# EAGLE design dasblinkenhat-controller-mk-3.0 (EAGLE 7.5.0)
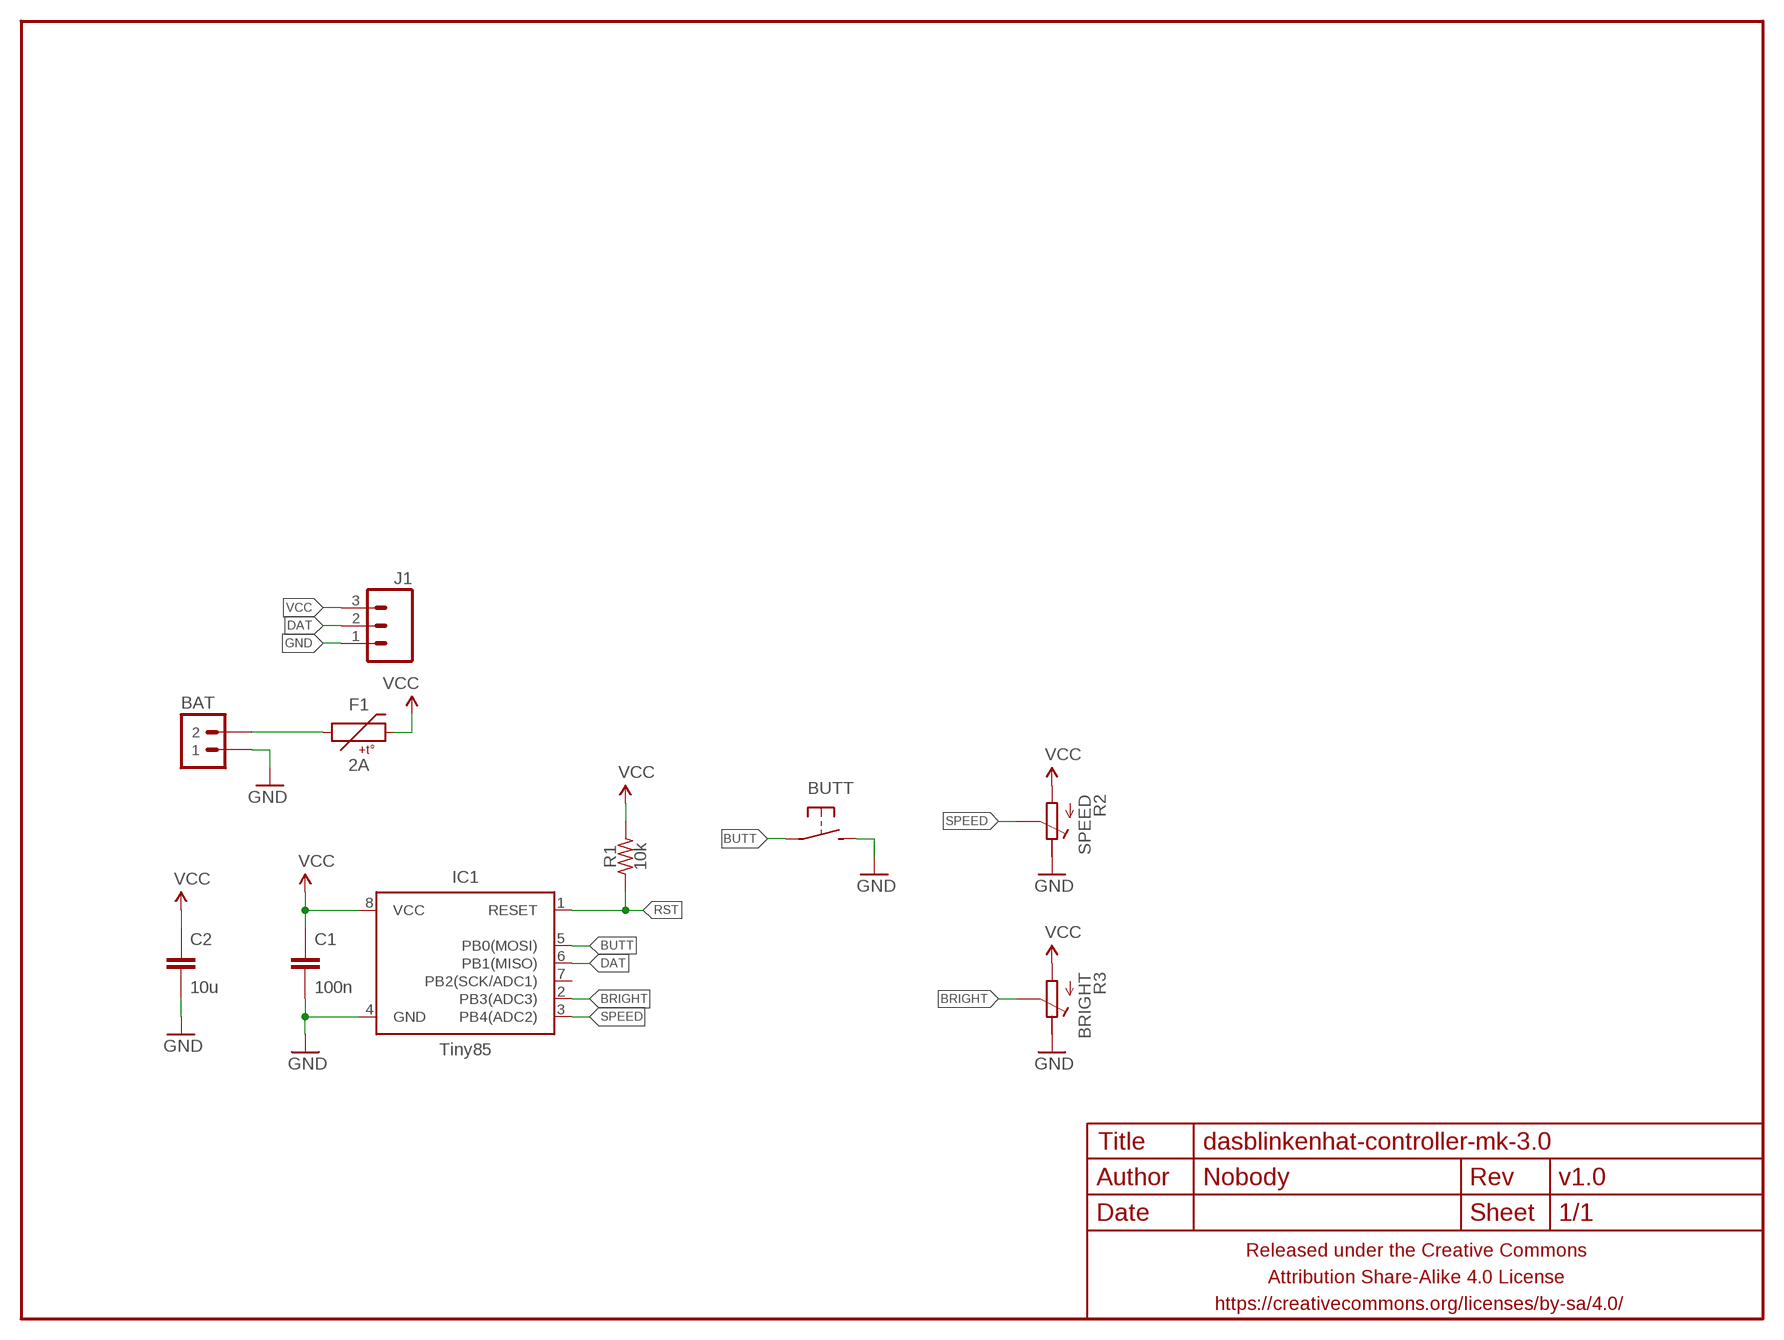
[diagram p0: schematic, sheet 1]

## Parts
BAT  M02JST-PTH-RA-R+  [JST-2-PH-RA-PTH-R+]
BUTT  DTS-6MM  SPST-NO-TACT6MM-SMD  [DTSM-6]
C1  100n  CAPACITOR-CERAMICC0603  [C0603]
C2  10u  CAPACITOR-CERAMICC1206  [C1206]
F1  2A  PTCSMD  [PTC-1206]
FRAME1  FRAME-LETTERNO_PACKAGE  [DUMMY]
IC1  Tiny85  ATTINY45TINY85-20-SOICW  [SO08-EIAJ]
J1  M03JST-XH-RA-PTH  [JST-3-XH-RA-PTH]
R1  10k  RESISTORR0603  [R0603]
R2  SPEED  POTENTIOMETEREVM3Y  [EVM3Y]
R3  BRIGHT  POTENTIOMETEREVM3Y  [EVM3Y]

## Nets
BRIGHT: IC1.2(PB3(ADC3)) R3.S
BUTT: BUTT.1 BUTT.2 IC1.5(PB0(MOSI))
DAT: IC1.6(PB1(MISO)) J1.2
GND: BAT.1 BUTT.3 BUTT.4 C1.2 C2.2 IC1.4(GND) J1.1 R2.E R3.E
N$1: BAT.2 F1.1
RST: IC1.1(RESET) R1.1
SPEED: IC1.3(PB4(ADC2)) R2.S
VCC: C1.1 C2.1 F1.2 IC1.8(VCC) J1.3 R1.2 R2.A R3.A
Unconnected: IC1.7(PB2(SCK/ADC1))

## Library data of the parts
BAT = a_parts:M02: Standard 2-pin 0.1" header. Use with - straight break away headers ( PRT-00116) - right angle break away headers (PRT-00553) - swiss pins (PRT-00743) - machine pins (PRT-00117) - female headers (PRT-00115) Molex polarized connector foot print use with: PRT-08233 with associated crimp pins and housings. 2.54_SCREWTERM for use with PRT-10571. 3.5mm Screw Terminal footprints for PRT-08084 5mm Screw Terminal footprints for use with PRT-08433
BUTT = A_butts:SPST-NO-TACT
C1 C2 = A_butts:CAPACITOR-CERAMIC: CAPACITOR, European symbol
F1 = a_parts:PTC: Resettable Fuse PTC Resettable Fuse. Spark Fun Electronics SKU : COM-08357; PROD_ID: RES-11150
FRAME1 = a_parts:FRAME-LETTER: Schematic Frame Standard 8.5x11 US Letter frame; DESIGNER: Nobody; VERSION: v1.0
IC1 = A_butts:ATTINY45: Atmel 8-pin 2/4/8kB flash uC; PROD_ID: IC-09092; VALUE: Tiny85-20-SMT
J1 = a_parts:M03: Header 3 Standard 3-pin 0.1" header. Use with straight break away headers (SKU : PRT-00116), right angle break away headers (PRT-00553), swiss pins (PRT-00743), machine pins (PRT-00117), and female headers (PRT-00115). Molex polarized connector foot print use with SKU : PRT-08232 with associated crimp pins and housings.
R1 = A_butts:RESISTOR: RESISTOR, American symbol
R2 R3 = a_parts:POTENTIOMETER: Trimm resistor

## Board
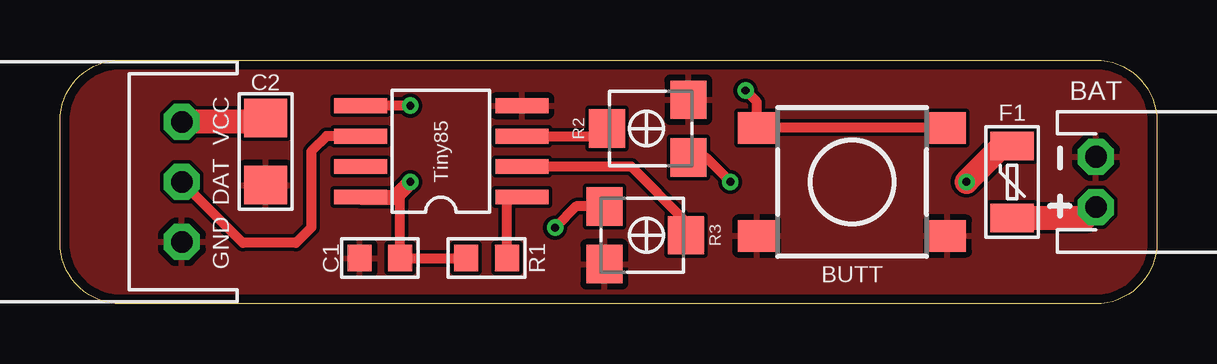
[diagram p1: board, top side]
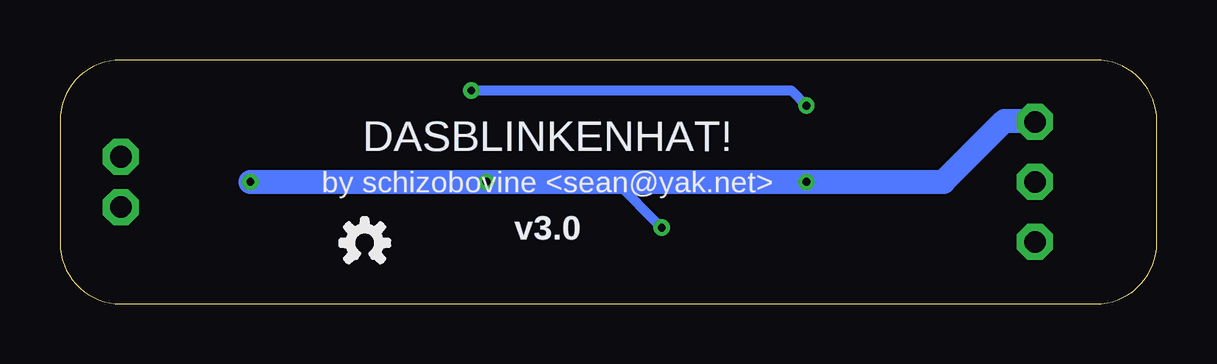
[diagram p2: board, bottom side, seen from below]

Size 45.72 x 10.16 mm. Coordinates in mm from the lower left corner, seen from the top.
Outline: 2.54,10.16 43.18,10.16 arc-90 45.72,7.62 45.72,2.54 arc-90 43.18,0 2.54,0 arc-90 0,2.54 0,7.62 arc-90 2.54,10.16
Copper layers (1*16): Top 0.0356mm / dielectric 1.5011mm / Bottom 0.0356mm
Design rules "LaenPCBOrder2": minimum track width 6mil, minimum drill 13mil, track to track 6mil, track to pad 6mil, pad to pad 6mil, via to via 6mil, smd to smd 6mil, copper to edge 15mil, drill to drill 6mil, minimum pad ring 7mil, minimum via ring 7mil, stop-mask expansion 3mil, vias tented up to drill 20mil, thermal gap 10mil

### Footprints (pad centres in the part's own frame; a part is rotated, then mirrored left to right if it is on the bottom)
JST-2-PH-RA-PTH-R+ = drill 0.9 pad 1.5 octagon: 1 -1.05,0; 2 1.05,0
DTSM-6 = smd 1.55 x 1.3: 1 -3.975,2.25; 2 3.975,2.25; 3 -3.975,-2.25; 4 3.975,-2.25
C0603 = smd 1 x 1.1: 1 -0.85,0; 2 0.85,0
C1206 = smd 1.6 x 1.8: 1 -1.4,0; 2 1.4,0
PTC-1206 = smd 1.2 x 1.8: 1 -1.5,0; 2 1.5,0
SO08-EIAJ = smd 0.61 x 2.21: 1 -1.905,-3.378; 2 -0.635,-3.378; 3 0.635,-3.378; 4 1.905,-3.378; 5 1.905,3.353; 6 0.635,3.353; 7 -0.635,3.353; 8 -1.905,3.353
JST-3-XH-RA-PTH = drill 0.9 pad 1.5 octagon: 1 -2.5,0; 2 0,0; 3 2.5,0
R0603 = smd 1 x 1.1: 1 -0.85,0; 2 0.85,0
EVM3Y = smd 1.6 x 1.5: A -1.2,-1.75; E 1.2,-1.75; S 0,1.65

### Placement (x,y rotation side)
BAT  43.18,5.08 270 top
BUTT  33.02,5.08 0 top
C1  13.34,1.91 180 top
C2  8.57,6.35 270 top
F1  39.69,5.08 90 top
FRAME1  0,0 0 top
IC1  15.88,6.35 90 top
J1  5.08,5.08 90 top
R1  17.78,1.91 180 top
R2  24.45,7.3 90 top
R3  24.45,2.86 270 top
U$2  [OSHWLOGO_TINY_SILKONLY]  33.02,2.54 0 bottom

### Tracks (layer width: path | path; a pad name or v marks a point on that pad's centre or on a via)
BRIGHT
  Top 0.406: R3.S 26.1,3.43 23.81,5.71 IC1.2
BUTT  (via drill 0.33)
  Top 0.406: BUTT.2 BUTT.1 29.05,8.42 v28.57,8.89 | v14.61,8.26 IC1.5
  Bottom 0.406: v28.57,8.89 15.24,8.89 v14.61,8.26
DAT
  Top 0.406: IC1.6 11.11,6.99 10.48,6.35 10.48,3.17 9.84,2.54 7.62,2.54 J1.2
GND
  pour Top: 2.54,10.16 43.18,10.16 arc-90 45.72,7.62 45.72,2.54 arc-90 43.18,0 2.54,0 arc-90 0,2.54 0,7.62 arc-90
N$1
  Top 1: F1.1 42.73,3.58 BAT.2
RST
  Top 0.406: R1.1 18.63,4.43 IC1.1
SPEED
  Top 0.406: IC1.3 22.48,6.99 R2.S
VCC  (via drill 0.33)
  Top 0.406: v14.61,5.08 14.19,4.66 C1.1 R1.2 | R2.A 26.92,6.1 v27.94,5.08 | R3.A 21.52,4.06 v20.64,3.17
  Top 0.635: IC1.8 13.97,4.45 v14.61,5.08
  Top 1: F1.2 39.28,6.58 v37.78,5.08 | C2.1 8.4,7.58 J1.3
  Bottom 0.406: v20.64,3.17 22.54,5.08
  Bottom 1: v37.78,5.08 v27.94,5.08 22.54,5.08 v14.61,5.08 8.89,5.08 6.35,7.62 5.12,7.62 J1.3

### Text on the board
tPlace: VCC | DAT | GND